# Altium schematic sheet current_sensor.SchDoc
size A
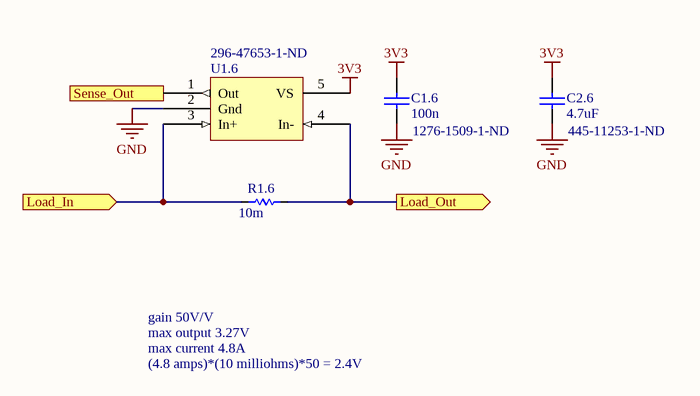
[diagram p0: current_sensor.SchDoc]

## Parts
C1.6  Supplier Part Number 1: 1276-1509-1-ND  [0402]  (hidden comment: 100n)
C2.6  4.7uF  Supplier Part Number 1: 445-11253-1-ND  [1608[0603]]
R1.6  10m  [0805]
U1.6  Supplier Part Number 1: 296-47653-1-ND  [SOT23-5]

## Ports
Load_In (in), Load_Out (out), Sense_Out (out)

## Nets
3V3: C1.6.1 C2.6.2 U1.6.5(VS)
GND: C1.6.2 C2.6.1 U1.6.2(Gnd)
Load_In: R1.6.2 U1.6.3(In+) ; port Load_In
Load_Out: R1.6.1 U1.6.4(In-) ; port Load_Out
Sense_Out: U1.6.1(Out) ; port Sense_Out

## Notes on the sheet
- gain 50V/V
- max output 3.27V
- max current 4.8A
- (4.8 amps)*(10 milliohms)*50 = 2.4V

## Library data of the parts
C1.6 = CAPACITOR NON_POL: Value: 100n; Supplier 1: Digi-Key
C2.6 = C0402: derates to 2.2; Value: 4.7uF; Supplier 1: Digi-Key
R1.6 = RESISTOR: ComponentLink1URL: http://www.susumu.co.jp/common/pdf/n_catalog_partition09_en.pdf; ComponentLink1Description: http://www.susumu.co.jp/common/pdf/n_catalog_partition09_en.pdf; ComponentLink2URL: http://uk.rs-online.com/webdocs/1107/0900766b81107548.pdf?src-supplier=RSComponents; ComponentLink2Description: http://uk.rs-online.com/webdocs/1107/0900766b81107548.pdf?src-supplier=RSComponents; Value: 10m
U1.6 = INA180: Current Sense Amp; ComponentLink1URL: http://www.ti.com/lit/ds/symlink/ina180.pdf; ComponentLink1Description: http://www.ti.com/lit/ds/symlink/ina180.pdf; Supplier 1: Digi-Key